# EAGLE design super7e (EAGLE 7.6.0)
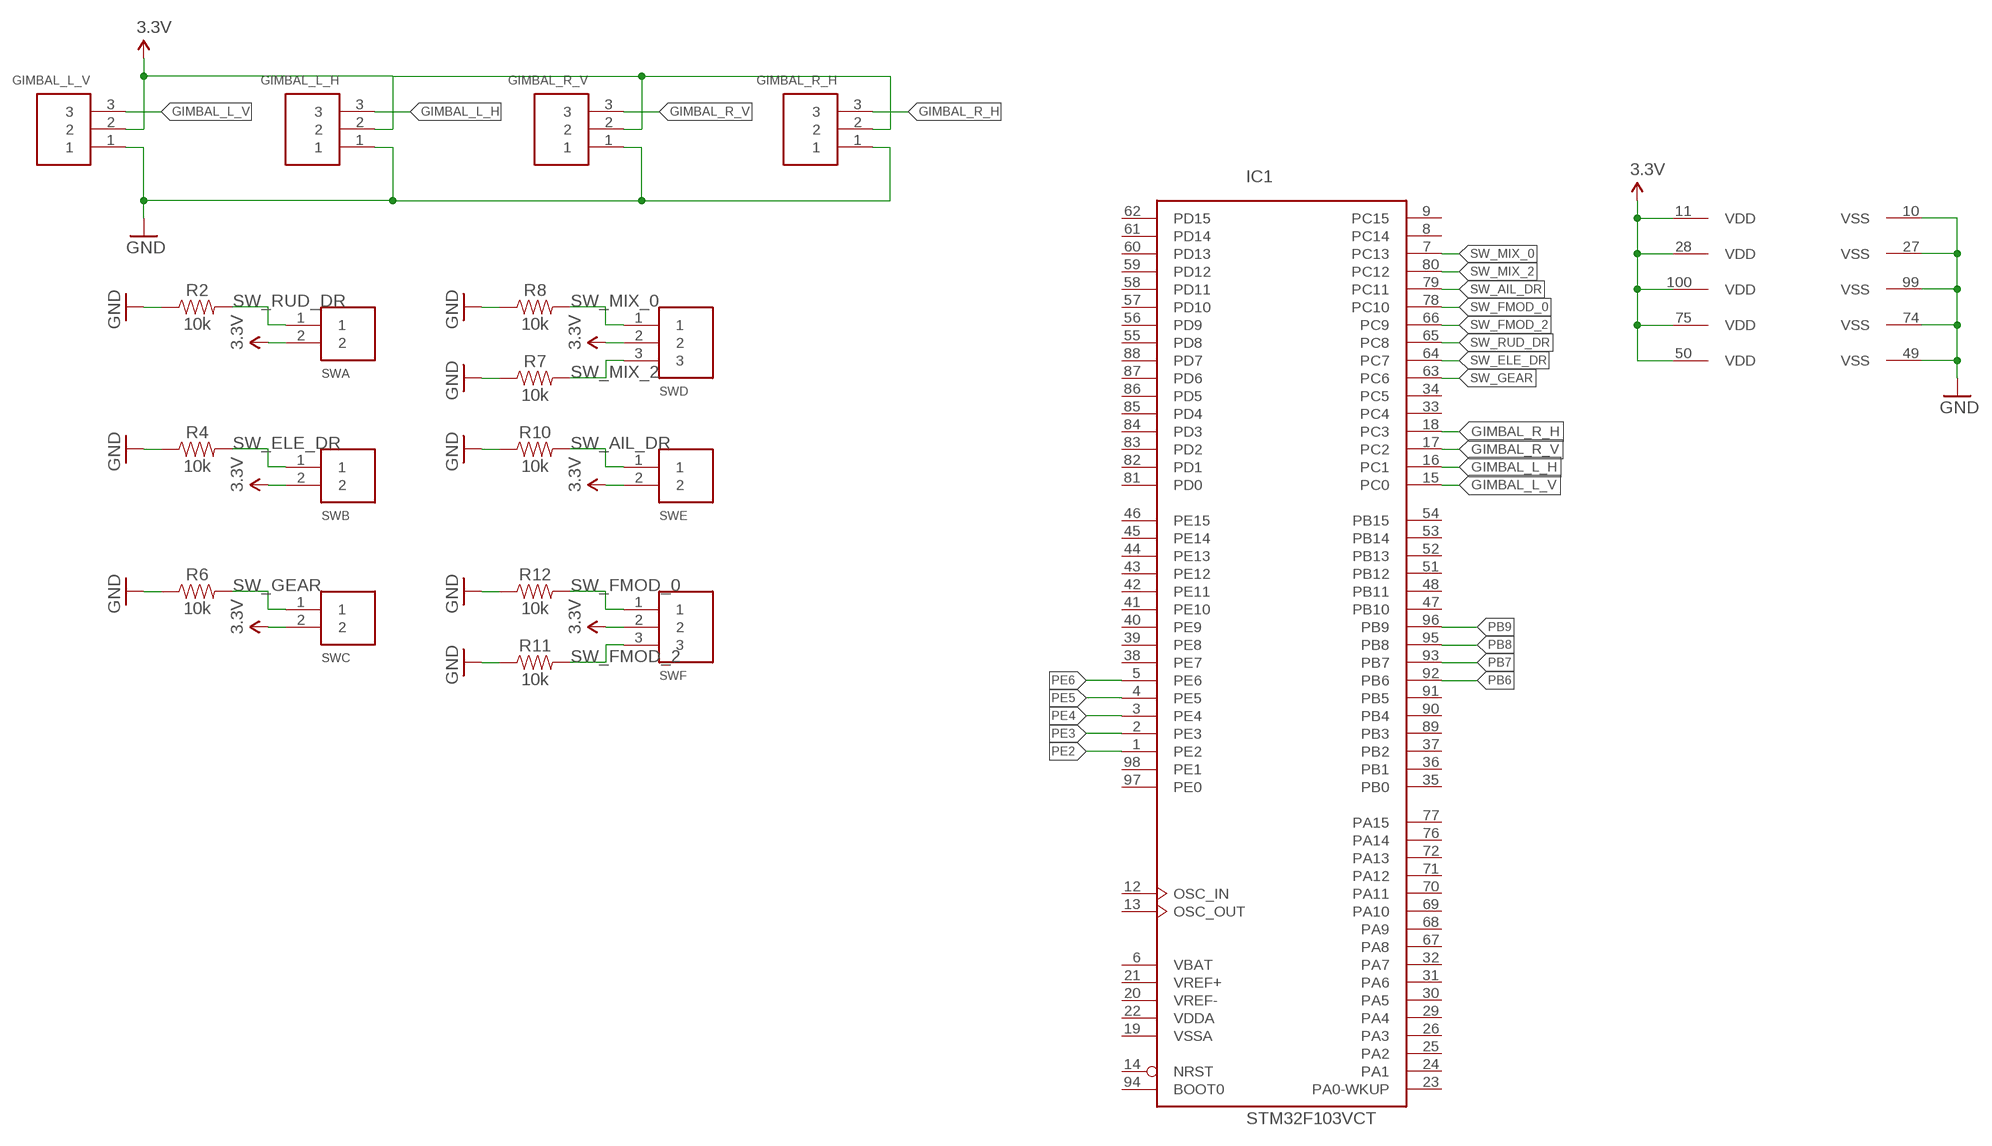
[diagram p0: schematic, sheet 1]

## Parts
GIMBAL_L_H  3PIN  [B3B-PH-K-S]
GIMBAL_L_V  3PIN  [B3B-PH-K-S]
GIMBAL_R_H  3PIN  [B3B-PH-K-S]
GIMBAL_R_V  3PIN  [B3B-PH-K-S]
IC1  STM32F103VCT  [LQFP100]
R2  10k  10KOHM-0603-1/10W-1%  [0603]
R4  10k  10KOHM-0603-1/10W-1%  [0603]
R6  10k  10KOHM-0603-1/10W-1%  [0603]
R7  10k  10KOHM-0603-1/10W-1%  [0603]
R8  10k  10KOHM-0603-1/10W-1%  [0603]
R10  10k  10KOHM-0603-1/10W-1%  [0603]
R11  10k  10KOHM-0603-1/10W-1%  [0603]
R12  10k  10KOHM-0603-1/10W-1%  [0603]
SWA  2PIN  [B2B-PH-K-S]
SWB  2PIN  [B2B-PH-K-S]
SWC  2PIN  [B2B-PH-K-S]
SWD  3PIN  [B3B-PH-K-S]
SWE  2PIN  [B2B-PH-K-S]
SWF  3PIN  [B3B-PH-K-S]

## Nets
3.3V: GIMBAL_L_H.2 GIMBAL_L_V.2 GIMBAL_R_H.2 GIMBAL_R_V.2 IC1.11(VDD) IC1.28(VDD) IC1.50(VDD) IC1.75(VDD) IC1.100(VDD) SWA.2 SWB.2 SWC.2 SWD.2 SWE.2 SWF.2
GIMBAL_L_H: GIMBAL_L_H.3 IC1.16(PC1)
GIMBAL_L_V: GIMBAL_L_V.3 IC1.15(PC0)
GIMBAL_R_H: GIMBAL_R_H.3 IC1.18(PC3)
GIMBAL_R_V: GIMBAL_R_V.3 IC1.17(PC2)
GND: GIMBAL_L_H.1 GIMBAL_L_V.1 GIMBAL_R_H.1 GIMBAL_R_V.1 IC1.10(VSS) IC1.27(VSS) IC1.49(VSS) IC1.74(VSS) IC1.99(VSS) R2.1 R4.1 R6.1 R7.1 R8.1 R10.1 R11.1 R12.1
PB6: IC1.92(PB6)
PB7: IC1.93(PB7)
PB8: IC1.95(PB8)
PB9: IC1.96(PB9)
PE2: IC1.1(PE2)
PE3: IC1.2(PE3)
PE4: IC1.3(PE4)
PE5: IC1.4(PE5)
PE6: IC1.5(PE6)
SW_AIL_DR: IC1.79(PC11) R10.2 SWE.1
SW_ELE_DR: IC1.64(PC7) R4.2 SWB.1
SW_FMOD_0: IC1.78(PC10) R12.2 SWF.1
SW_FMOD_2: IC1.66(PC9) R11.2 SWF.3
SW_GEAR: IC1.63(PC6) R6.2 SWC.1
SW_MIX_0: IC1.7(PC13) R8.2 SWD.1
SW_MIX_2: IC1.80(PC12) R7.2 SWD.3
SW_RUD_DR: IC1.65(PC8) R2.2 SWA.1
Unconnected: IC1.8(PC14) IC1.9(PC15) IC1.12(OSC_IN) IC1.13(OSC_OUT) IC1.14(NRST) IC1.23(PA0-WKUP) IC1.24(PA1) IC1.25(PA2) IC1.26(PA3) IC1.29(PA4) IC1.30(PA5) IC1.31(PA6) IC1.32(PA7) IC1.33(PC4) IC1.34(PC5) IC1.35(PB0) IC1.36(PB1) IC1.37(PB2) IC1.38(PE7) IC1.39(PE8) IC1.40(PE9) IC1.41(PE10) IC1.42(PE11) IC1.43(PE12) IC1.44(PE13) IC1.45(PE14) IC1.46(PE15) IC1.47(PB10) IC1.48(PB11) IC1.51(PB12) IC1.52(PB13) IC1.53(PB14) IC1.54(PB15) IC1.55(PD8) IC1.56(PD9) IC1.57(PD10) IC1.58(PD11) IC1.59(PD12) IC1.60(PD13) IC1.61(PD14) IC1.62(PD15) IC1.67(PA8) IC1.68(PA9) IC1.69(PA10) IC1.70(PA11) IC1.71(PA12) IC1.72(PA13) IC1.76(PA14) IC1.77(PA15) IC1.81(PD0) IC1.82(PD1) IC1.83(PD2) IC1.84(PD3) IC1.85(PD4) IC1.86(PD5) IC1.87(PD6) IC1.88(PD7) IC1.89(PB3) IC1.90(PB4) IC1.91(PB5) IC1.94(BOOT0) IC1.97(PE0) IC1.98(PE1)

## Power pins joined to a net without a drawn wire
VBAT: IC1.6(VBAT)
VDDA: IC1.22(VDDA)
VREF+: IC1.21(VREF+)
VREF-: IC1.20(VREF-)
VSSA: IC1.19(VSSA)

## Library data of the parts
GIMBAL_L_H GIMBAL_L_V GIMBAL_R_H GIMBAL_R_V SWD SWF = jst_eph:3PIN
IC1 = micro-stm_v2:STM32F103V*T: ARM 32-bit Cortex™-M3 CPU 72 MHz maximum frequency 64 to 1028 Kbytes of Flash memory 20 to 96 kbytes of SRAM 80 GPIOs 2.0 to 3.6 V application supply
R2 R4 R6-R8 R10-R12 = SparkFun-Resistors:10KOHM: 10kΩ resistor A resistor is a passive two-terminal electrical component that implements electrical resistance as a circuit element. Resistors act to reduce current flow, and, at the same time, act to lower voltage levels within circuits.; PROD_ID: RES-00824
SWA SWB SWC SWE = jst_eph:2PIN

## Board
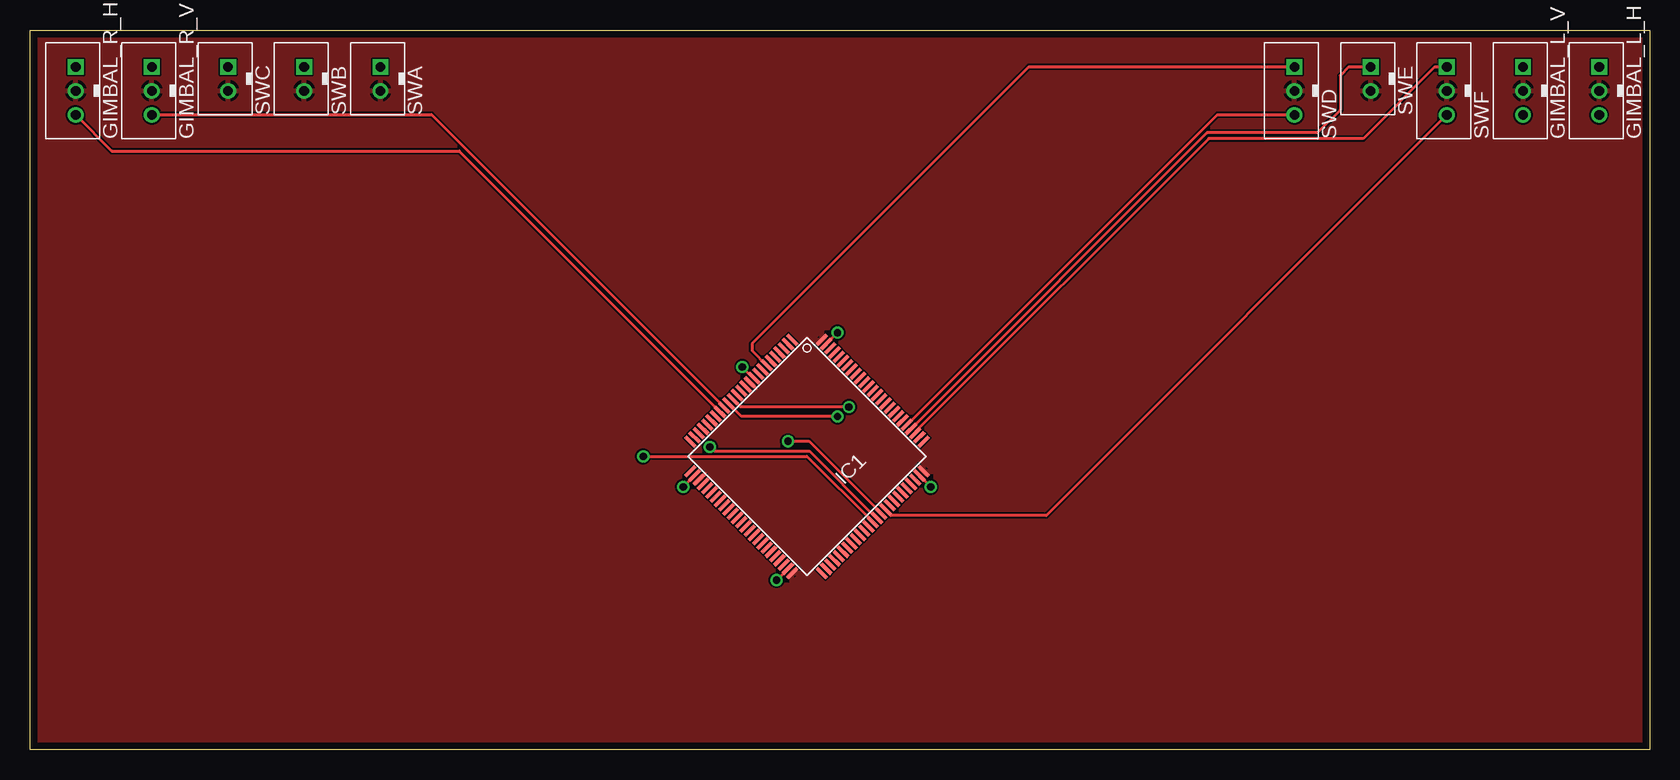
[diagram p1: board, top side]
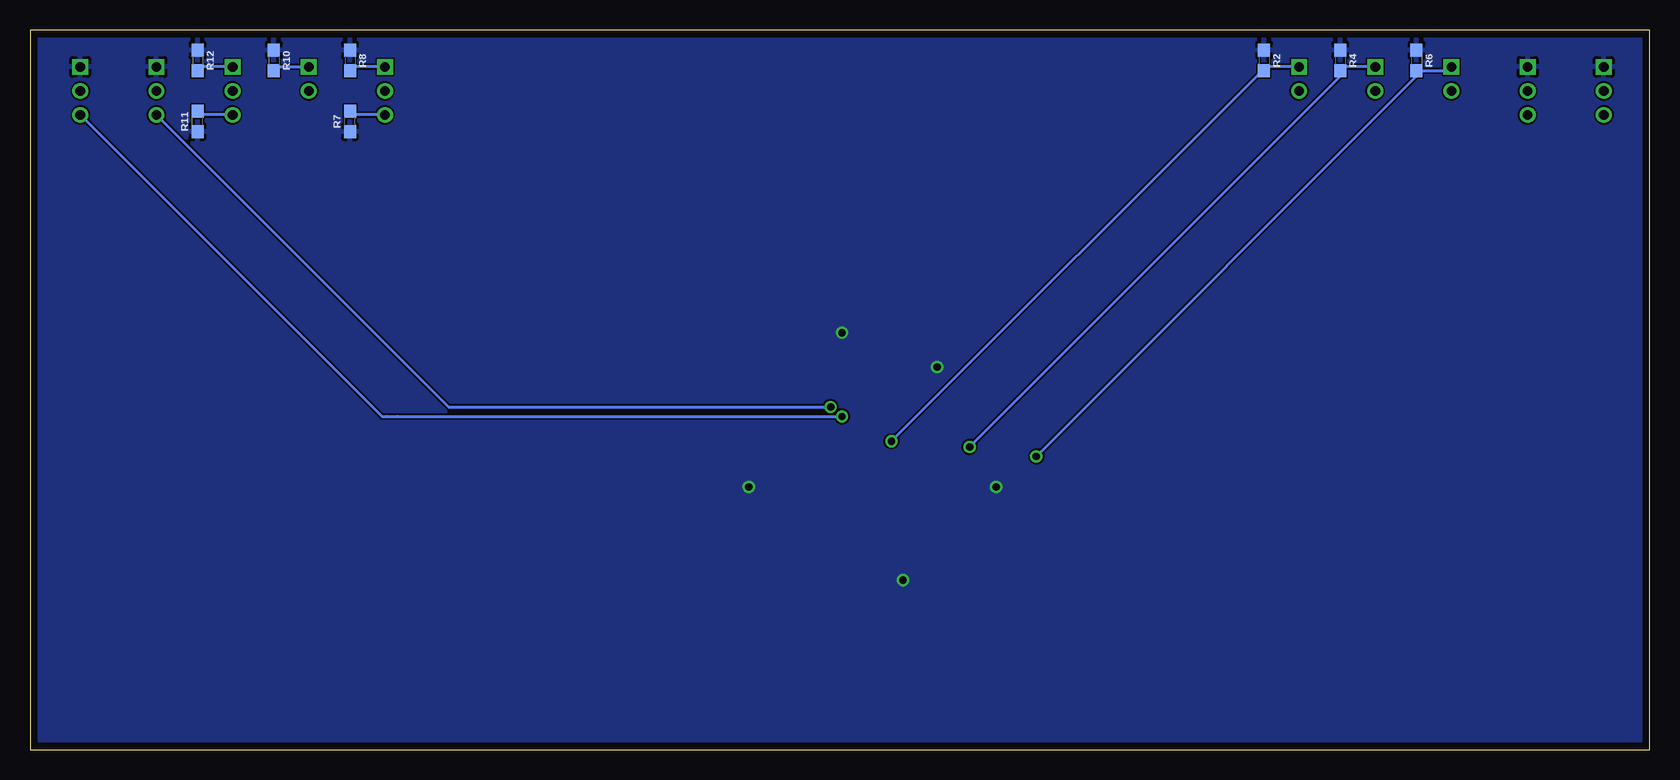
[diagram p2: board, bottom side, seen from below]

Size 135 x 60 mm. Coordinates in mm from the lower left corner, seen from the top.
Outline: 0,60 135,60 135,0 0,0 0,60
Copper layers (1*16): Top 0.035mm / dielectric 1.5mm / Bottom 0.035mm
Design rules "default *": minimum track width 10mil, minimum drill 24mil, track to track 6mil, track to pad 6mil, pad to pad 6mil, via to via 6mil, smd to smd 6mil, copper to edge 24mil, drill to drill 8mil, minimum pad ring 10mil, minimum via ring 8mil, stop-mask expansion 4mil, vias tented up to drill 0mil, thermal gap 10mil

### Footprints (pad centres in the part's own frame; a part is rotated, then mirrored left to right if it is on the bottom)
B3B-PH-K-S = drill 0.813 square: 1 2,0 | drill 0.813: 2 0,0; 3 -2,0
LQFP100 = smd 0.3 x 1.2: 1 -6,-7.75; 2 -5.5,-7.75; 3 -5,-7.75; 4 -4.5,-7.75; 5 -4,-7.75; 6 -3.5,-7.75; 7 -3,-7.75; 8 -2.5,-7.75; 9 -2,-7.75; 10 -1.5,-7.75; 11 -1,-7.75; 12 -0.5,-7.75; 13 0,-7.75; 14 0.5,-7.75; 15 1,-7.75; 16 1.5,-7.75; 17 2,-7.75; 18 2.5,-7.75; 19 3,-7.75; 20 3.5,-7.75; 21 4,-7.75; 22 4.5,-7.75; 23 5,-7.75; 24 5.5,-7.75; 25 6,-7.75; 51 6,7.75; 52 5.5,7.75; 53 5,7.75; 54 4.5,7.75; 55 4,7.75; 56 3.5,7.75; 57 3,7.75; 58 2.5,7.75; 59 2,7.75; 60 1.5,7.75; 61 1,7.75; 62 0.5,7.75; 63 0,7.75; 64 -0.5,7.75; 65 -1,7.75; 66 -1.5,7.75; 67 -2,7.75; 68 -2.5,7.75; 69 -3,7.75; 70 -3.5,7.75; 71 -4,7.75; 72 -4.5,7.75; 73 -5,7.75; 74 -5.5,7.75; 75 -6,7.75 | smd 1.2 x 0.3: 26 7.75,-6; 27 7.75,-5.5; 28 7.75,-5; 29 7.75,-4.5; 30 7.75,-4; 31 7.75,-3.5; 32 7.75,-3; 33 7.75,-2.5; 34 7.75,-2; 35 7.75,-1.5; 36 7.75,-1; 37 7.75,-0.5; 38 7.75,0; 39 7.75,0.5; 40 7.75,1; 41 7.75,1.5; 42 7.75,2; 43 7.75,2.5; 44 7.75,3; 45 7.75,3.5; 46 7.75,4; 47 7.75,4.5; 48 7.75,5; 49 7.75,5.5; 50 7.75,6; 76 -7.75,6; 77 -7.75,5.5; 78 -7.75,5; 79 -7.75,4.5; 80 -7.75,4; 81 -7.75,3.5; 82 -7.75,3; 83 -7.75,2.5; 84 -7.75,2; 85 -7.75,1.5; 86 -7.75,1; 87 -7.75,0.5; 88 -7.75,0; 89 -7.75,-0.5; 90 -7.75,-1; 91 -7.75,-1.5; 92 -7.75,-2; 93 -7.75,-2.5; 94 -7.75,-3; 95 -7.75,-3.5; 96 -7.75,-4; 97 -7.75,-4.5; 98 -7.75,-5; 99 -7.75,-5.5; 100 -7.75,-6
0603 = smd 1.1 x 1: 1 -0.85,0; 2 0.85,0
B2B-PH-K-S = drill 0.813 square: 1 2,0 | drill 0.813: 2 0,0

### Placement (x,y rotation side)
GIMBAL_L_H  130.81,54.92 90 top
GIMBAL_L_V  124.46,54.92 90 top
GIMBAL_R_H  3.81,54.92 90 top
GIMBAL_R_V  10.16,54.92 90 top
IC1  64.77,24.44 225 top
R2  32.13,57.46 270 bottom
R4  25.78,57.46 270 bottom
R6  19.43,57.46 270 bottom
R7  108.33,52.38 90 bottom
R8  108.33,57.46 270 bottom
R10  114.68,57.46 270 bottom
R11  121.03,52.38 90 bottom
R12  121.03,57.46 270 bottom
SWA  29.21,54.92 90 top
SWB  22.86,54.92 90 top
SWC  16.51,54.92 90 top
SWD  105.41,54.92 90 top
SWE  111.76,54.92 90 top
SWF  118.11,54.92 90 top

### Tracks (layer width: path | path; a pad name or v marks a point on that pad's centre or on a via)
3.3V
  Top 0.254: IC1.28 55.88,22.53 56.2,22.85 56.29,23.03 | 60.53,30.09 60.48,30.16 IC1.11
  pour Top: 135,60 0,60 0,0 135,0
GIMBAL_L_H  (via drill 0.61)
  Top 0.254: v67.31,27.77 59.31,27.77 IC1.16
  Bottom 0.254: v67.31,27.77 104.39,27.77 105.25,27.77 105.66,27.77 GIMBAL_L_H.3
GIMBAL_L_V  (via drill 0.61)
  Top 0.254: v68.26,28.57 59.21,28.57 IC1.15
  Bottom 0.254: v68.26,28.57 100.11,28.57 GIMBAL_L_V.3
GIMBAL_R_H
  Top 0.254: GIMBAL_R_H.3 6.83,49.9 35.77,49.9 IC1.18
GIMBAL_R_V
  Top 0.254: GIMBAL_R_V.3 30.99,52.92 33.43,52.92 33.46,52.92 IC1.17
GND  (via drill 0.61)
  Top 0.254: v54.45,21.9 55.24,22.69 IC1.27 | v59.37,31.9 60.33,30.95 IC1.10 | v62.23,14.12 63.02,14.91 IC1.49 | v67.31,34.76 66.52,33.97 IC1.99 | v75.09,21.9 74.3,22.69 IC1.74
  pour Bottom: 0,60 135,60 135,0 0,0
SW_AIL_DR
  Top 0.254: IC1.79 73.5,26.82 98.11,51.43 107.31,51.43 109.22,53.33 109.22,56.19 109.95,56.92 SWE.1
  Bottom 0.254: R10.2 114.62,56.67 114.62,56.92 SWE.1
SW_ELE_DR  (via drill 0.61)
  Top 0.254: IC1.64 70.48,19.36 64.96,24.88 57.02,24.88 v56.67,25.23
  Bottom 0.254: SWB.1 25.47,56.92 R4.2 25.78,56.13 v56.67,25.23
SW_FMOD_0
  Top 0.254: IC1.78 73.82,26.5 98.27,50.95 111.12,50.95 117.09,56.92 SWF.1
  Bottom 0.254: 120.97,56.67 R12.2 120.72,56.92 SWF.1
SW_FMOD_2
  Top 0.254: IC1.66 71.28,19.99 71.75,19.52 84.71,19.52 SWF.3
  Bottom 0.254: SWF.3 120.72,52.92 R11.2
SW_GEAR  (via drill 0.61)
  Top 0.254: IC1.63 64.77,24.44 v51.12,24.44
  Bottom 0.254: SWC.1 16.82,56.61 R6.2 19.43,56.13 v51.12,24.44
SW_MIX_0
  Top 0.254: IC1.7 60.2,33.25 60.2,33.84 83.28,56.92 SWD.1
  Bottom 0.254: 108.27,56.67 R8.2 108.02,56.92 SWD.1
SW_MIX_2
  Top 0.254: IC1.80 73.18,27.14 98.97,52.92 SWD.3
  Bottom 0.254: SWD.3 108.02,52.92 R7.2
SW_RUD_DR  (via drill 0.61)
  Top 0.254: v63.18,25.71 64.93,25.71 IC1.65
  Bottom 0.254: SWA.1 31.82,56.92 R2.2 32.28,56.61 v63.18,25.71